# EAGLE design Instrument Cluster 2 (EAGLE 9.6.2)
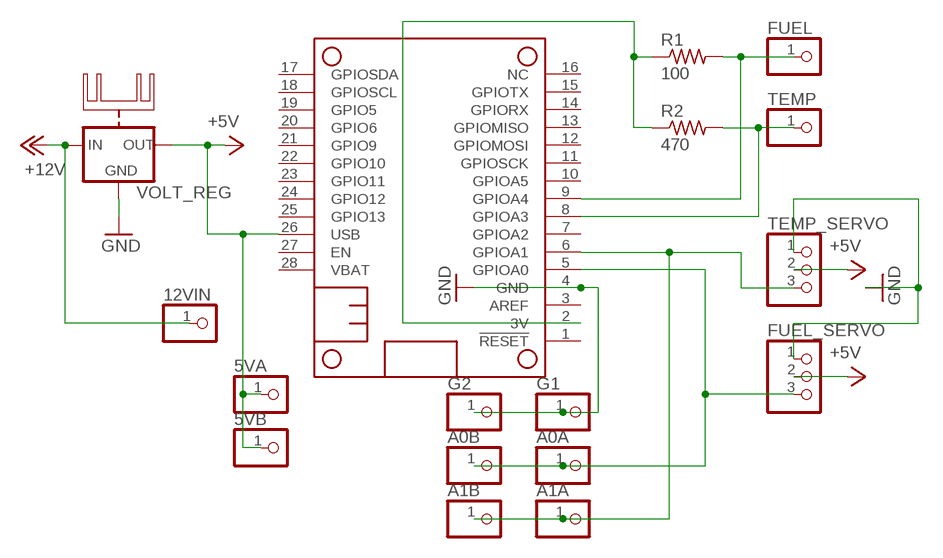
[diagram p0: schematic, sheet 1]

## Parts
5VA  PINHD-1X1  [1X01]
5VB  PINHD-1X1  [1X01]
12VIN  PINHD-1X1  [1X01]
A0A  PINHD-1X1  [1X01]
A0B  PINHD-1X1  [1X01]
A1A  PINHD-1X1  [1X01]
A1B  PINHD-1X1  [1X01]
FUEL  PINHD-1X1  [1X01]
FUEL_SERVO  PINHD-1X3  [1X03]
G1  PINHD-1X1  [1X01]
G2  PINHD-1X1  [1X01]
MS2  FEATHERWING_NODIM  [FEATHERWING_DIM]
R1  100  R-US_0309/12  [0309/12]
R2  470  R-US_0309/12  [0309/12]
TEMP  PINHD-1X1  [1X01]
TEMP_SERVO  PINHD-1X3  [1X03]
VOLT_REG  78XXH  [78XXH]

## Nets
3V: MS2.2(3V) R1.1 R2.1
+5V: 5VA.1 5VB.1 FUEL_SERVO.2 MS2.26(USB) TEMP_SERVO.2 VOLT_REG.OUT
+12V: 12VIN.1 VOLT_REG.IN
A0: A0A.1 A0B.1 FUEL_SERVO.3 MS2.5(GPIOA0)
A1: A1A.1 A1B.1 MS2.6(GPIOA1) TEMP_SERVO.3
A3: MS2.8(GPIOA3) R2.2 TEMP.1
A4: FUEL.1 MS2.9(GPIOA4) R1.2
GND: FUEL_SERVO.1 G1.1 G2.1 MS2.4(GND) TEMP_SERVO.1 VOLT_REG.GND
Unconnected: MS2.1(!RESET) MS2.3(AREF) MS2.7(GPIOA2) MS2.10(GPIOA5) MS2.11(GPIOSCK) MS2.12(GPIOMOSI) MS2.13(GPIOMISO) MS2.14(GPIORX) MS2.15(GPIOTX) MS2.16(NC) MS2.17(GPIOSDA) MS2.18(GPIOSCL) MS2.19(GPIO5) MS2.20(GPIO6) MS2.21(GPIO9) MS2.22(GPIO10) MS2.23(GPIO11) MS2.24(GPIO12) MS2.25(GPIO13) MS2.27(EN) MS2.28(VBAT)

## Library data of the parts
5VA 5VB 12VIN A0A A0B A1A A1B FUEL G1 G2 TEMP = adafruit:PINHD-1X1: Pin header 1x1 for 0.1" spacing With round pins
FUEL_SERVO TEMP_SERVO = adafruit:PINHD-1X3: PIN HEADER
MS2 = adafruit:FEATHERWING
R1 R2 = adafruit:R-US_: RESISTOR, American symbol
VOLT_REG = 78xx_with_heatsink:78XXH: VOLTAGE REGULATOR

## Board
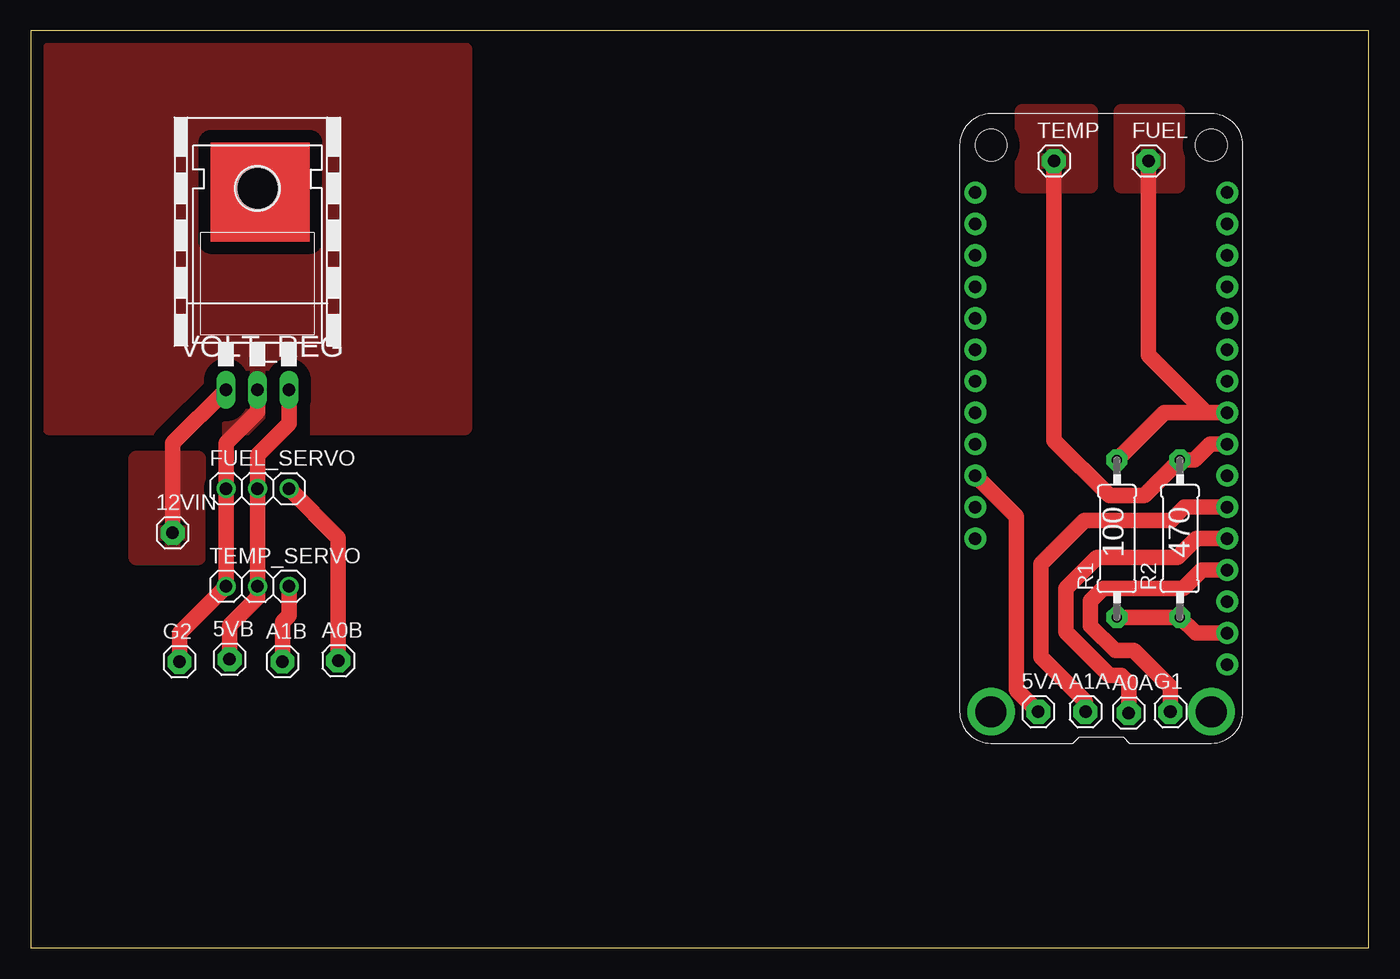
[diagram p1: board, top side]
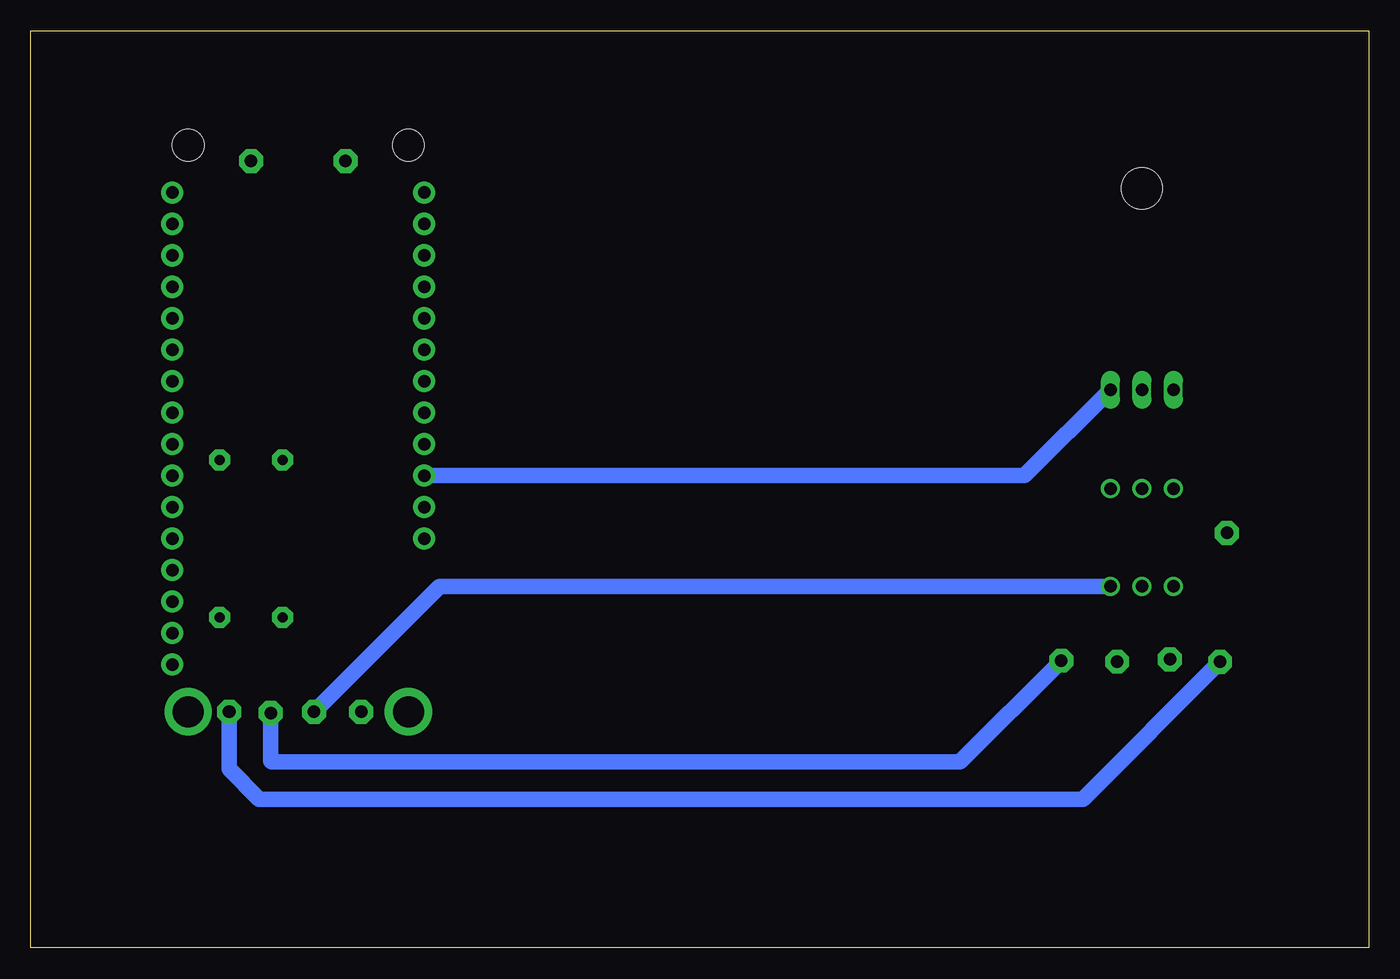
[diagram p2: board, bottom side, seen from below]

Size 107.93 x 73.99 mm. Coordinates in mm from the lower left corner, seen from the top.
Outline: 0,0 107.93,0 107.93,73.99 0,73.99 0,0
Copper layers (1*16): Top 0.035mm / dielectric 1.5mm / Bottom 0.035mm
Design rules "default": minimum track width 6mil, minimum drill 0.35mm, track to track 6mil, track to pad 6mil, pad to pad 6mil, via to via 6mil, smd to smd 6mil, copper to edge 40mil, drill to drill 6mil, minimum pad ring 10mil, minimum via ring 8mil, stop-mask expansion 4mil, vias tented up to drill 0mil, thermal gap 10mil

### Footprints (pad centres in the part's own frame; a part is rotated, then mirrored left to right if it is on the bottom)
1X01 = drill 1.016 pad 1.93 octagon: 1 0,0
1X03 = drill 1.016: 1 -2.54,0; 2 0,0; 3 2.54,0
FEATHERWING_DIM = drill 1 pad 1.778: 1 6.35,1.27; 2 8.89,1.27; 3 11.43,1.27; 4 13.97,1.27; 5 16.51,1.27; 6 19.05,1.27; 7 21.59,1.27; 8 24.13,1.27; 9 26.67,1.27; 10 29.21,1.27; 11 31.75,1.27; 12 34.29,1.27; 13 36.83,1.27; 14 39.37,1.27; 15 41.91,1.27; 16 44.45,1.27; 17 44.45,21.59; 18 41.91,21.59; 19 39.37,21.59; 20 36.83,21.59; 21 34.29,21.59; 22 31.75,21.59; 23 29.21,21.59; 24 26.67,21.59; 25 24.13,21.59; 26 21.59,21.59; 27 19.05,21.59; 28 16.51,21.59 | drill 2.5 pad 3.81: P$1 2.54,20.32; P$2 2.54,2.54 | hole 2.54: 48.26,20.32; 48.26,2.54
0309/12 = drill 0.813 pad 1.676 octagon: 1 -6.35,0; 2 6.35,0
78XXH = drill 1.016 long: GND 0,-5.08; IN -2.54,-5.08; OUT 2.54,-5.08 | hole 3.302: 0,11.176

### Placement (x,y rotation side)
5VA  81.28,19.05 0 top
5VB  16.02,23.28 0 top
12VIN  11.43,33.49 0 top
A0A  88.58,18.94 0 top
A0B  24.79,23.17 0 top
A1A  85.09,19.05 0 top
A1B  20.29,23.09 0 top
FUEL  90.17,63.5 0 top
FUEL_SERVO  18.28,37.06 0 top
G1  91.94,19.05 0 top
G2  11.98,23.08 0 top
MS2  97.79,16.51 90 top
R1  87.63,33.02 90 top
R2  92.71,33.02 90 top
TEMP  82.55,63.5 0 top
TEMP_SERVO  18.28,29.17 0 top
VOLT_REG  18.28,50.11 0 top

### Tracks (layer width: path | path; a pad name or v marks a point on that pad's centre or on a via)
3V
  Top 1.27: MS2.2 93.98,25.4 R2.1 R1.1
+5V
  Top 1.27: MS2.26 79.5,34.8 79.5,20.83 5VA.1 | VOLT_REG.OUT 20.82,42.31 18.28,39.77 FUEL_SERVO.2 TEMP_SERVO.2 18.28,28.27 16.02,26.01 5VB.1
  Bottom 1.27: MS2.26 27.75,38.1 VOLT_REG.OUT
+12V
  Top 1.27: VOLT_REG.IN 11.43,40.72 12VIN.1
  pour Top (isolate 1.016): 13.5,39.49 8.5,39.49 8.5,31.49 13.5,31.49
A0
  Top 1.27: MS2.5 94.03,33.02 92.5,31.49 86,31.49 83.5,28.99 83.5,25.49 87,21.99 88,21.99 88.58,21.41 A0A.1 | FUEL_SERVO.3 24.79,33.09 A0B.1
  Bottom 1.27: A0A.1 88.58,15.07 88.5,14.99 32.97,14.99 A0B.1
A1
  Top 1.27: MS2.6 93.07,35.56 92,34.49 85,34.49 81.5,30.99 81.5,23.49 85.09,19.9 A1A.1 | A1B.1 20.29,26.28 20.82,26.81 TEMP_SERVO.3
  Bottom 1.27: A1A.1 74.97,29.17 TEMP_SERVO.3
A3
  Top 1.27: MS2.8 95.15,40.64 93.88,39.37 R2.2 89.83,36.49 87,36.49 82.55,40.94 TEMP.1
  pour Top (isolate 1.016): 80,67.49 80,61.49 85.5,61.49 85.5,67.49 80.5,67.49
A4
  Top 0.813: 94.81,43.18 MS2.9
  Top 1.27: FUEL.1 90.17,47.82 94.81,43.18 | R1.2 91.44,43.18 MS2.9
  pour Top (isolate 1.016): 88,67.49 88,61.49 92.5,61.49 92.5,67.49
GND
  Top 1.27: MS2.4 94.49,30.48 93,28.99 86.5,28.99 85.5,27.99 85.5,25.99 87.5,23.99 89,23.99 91.94,21.05 G1.1 | VOLT_REG.GND 18.28,43.27 15.74,40.73 FUEL_SERVO.1 TEMP_SERVO.1 11.98,25.41 G2.1
  Bottom 1.27: G1.1 91.94,14.43 89.5,11.99 23.07,11.99 G2.1
  pour Top (isolate 1.016): 1.5,72.49 35,72.49 35,41.99 1.5,41.99
(copper drawn outside any net)
  shapes: Top area x1

### Text on the board
tNames: 100 / / 470